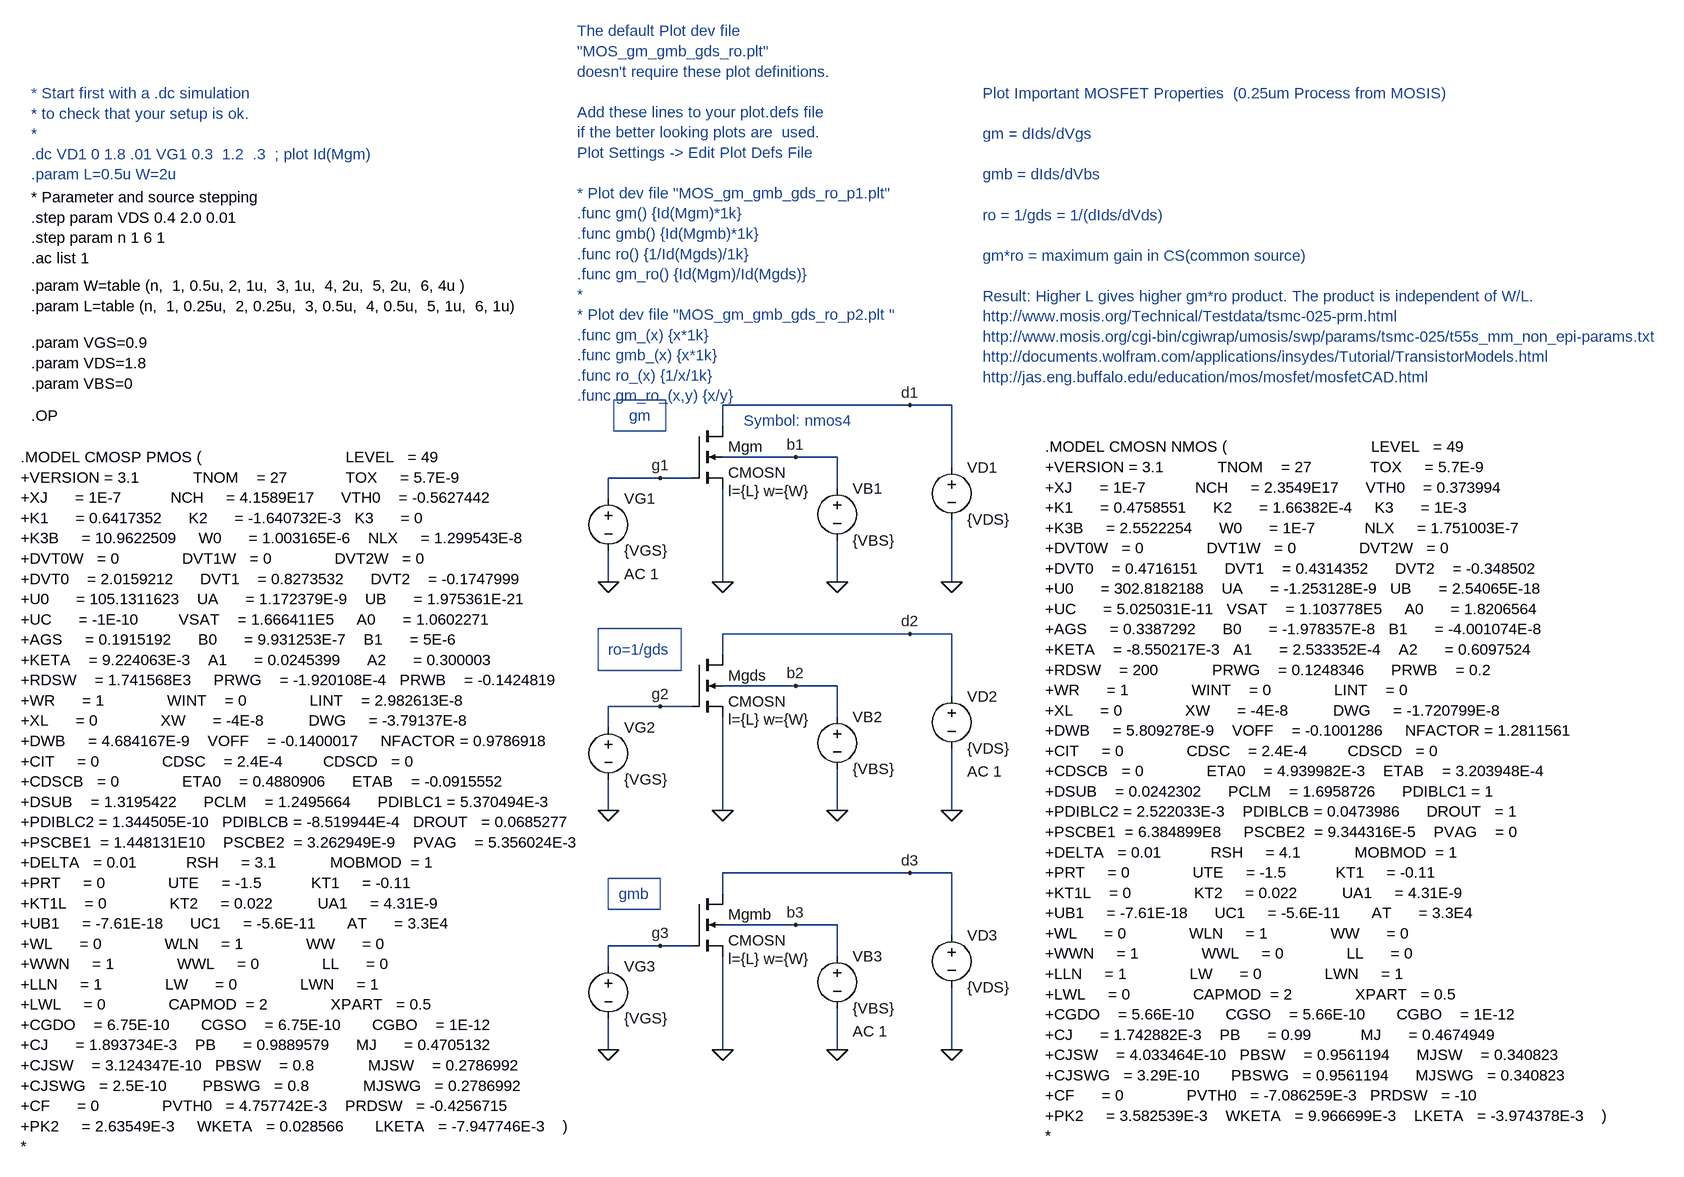
[diagram p0: schematic MOS_gm_gmb_gds_ro.asc]
MOS_gm_gmb_gds_ro.asc, the LTspice schematic file:
Version 4
SHEET 1 3220 2244
WIRE -400 256 -400 224
WIRE -400 384 -400 336
WIRE -400 608 -400 576
WIRE -400 736 -400 688
WIRE -400 976 -400 944
WIRE -400 1104 -400 1056
WIRE -320 224 -400 224
WIRE -320 576 -400 576
WIRE -320 944 -400 944
WIRE -272 224 -320 224
WIRE -272 576 -320 576
WIRE -272 944 -320 944
WIRE -224 144 -224 112
WIRE -224 384 -224 240
WIRE -224 496 -224 464
WIRE -224 736 -224 592
WIRE -224 864 -224 832
WIRE -224 1104 -224 960
WIRE -112 192 -224 192
WIRE -112 544 -224 544
WIRE -112 912 -224 912
WIRE -48 192 -112 192
WIRE -48 240 -48 192
WIRE -48 384 -48 320
WIRE -48 544 -112 544
WIRE -48 592 -48 544
WIRE -48 736 -48 672
WIRE -48 912 -112 912
WIRE -48 960 -48 912
WIRE -48 1104 -48 1040
WIRE 64 112 -224 112
WIRE 64 464 -224 464
WIRE 64 832 -224 832
WIRE 128 112 64 112
WIRE 128 208 128 112
WIRE 128 384 128 288
WIRE 128 464 64 464
WIRE 128 560 128 464
WIRE 128 736 128 640
WIRE 128 832 64 832
WIRE 128 928 128 832
WIRE 128 1104 128 1008
FLAG -400 384 0
FLAG 128 384 0
FLAG -320 224 g1
FLAG -48 384 0
FLAG -224 384 0
FLAG -400 736 0
FLAG 128 736 0
FLAG -320 576 g2
FLAG 64 464 d2
FLAG -48 736 0
FLAG -112 544 b2
FLAG -224 736 0
FLAG -400 1104 0
FLAG 128 1104 0
FLAG -320 944 g3
FLAG 64 832 d3
FLAG -48 1104 0
FLAG -112 912 b3
FLAG -224 1104 0
FLAG -112 192 b1
FLAG 64 112 d1
SYMBOL voltage 128 192 R0
SYMATTR InstName VD1
SYMATTR Value {VDS}
SYMBOL voltage -400 240 R0
WINDOW 123 24 132 Left 0
WINDOW 39 0 0 Left 0
SYMATTR Value2 AC 1
SYMATTR InstName VG1
SYMATTR Value {VGS}
SYMBOL nmos4 -272 144 R0
WINDOW 123 56 100 Left 0
SYMATTR Value2 l={L} w={W}
SYMATTR InstName Mgm
SYMATTR Value CMOSN
SYMBOL voltage -48 224 R0
SYMATTR InstName VB1
SYMATTR Value {VBS}
SYMBOL voltage 128 544 R0
WINDOW 123 24 132 Left 0
WINDOW 39 0 0 Left 0
SYMATTR Value2 AC 1
SYMATTR InstName VD2
SYMATTR Value {VDS}
SYMBOL voltage -400 592 R0
WINDOW 123 24 132 Left 0
WINDOW 39 0 0 Left 0
SYMATTR InstName VG2
SYMATTR Value {VGS}
SYMBOL voltage -48 576 R0
SYMATTR InstName VB2
SYMATTR Value {VBS}
SYMBOL voltage 128 912 R0
SYMATTR InstName VD3
SYMATTR Value {VDS}
SYMBOL voltage -400 960 R0
WINDOW 123 24 132 Left 0
WINDOW 39 0 0 Left 0
SYMATTR InstName VG3
SYMATTR Value {VGS}
SYMBOL voltage -48 944 R0
WINDOW 123 24 132 Left 0
WINDOW 39 0 0 Left 0
SYMATTR Value2 AC 1
SYMATTR InstName VB3
SYMATTR Value {VBS}
SYMBOL nmos4 -272 496 R0
WINDOW 123 56 100 Left 0
SYMATTR Value2 l={L} w={W}
SYMATTR InstName Mgds
SYMATTR Value CMOSN
SYMBOL nmos4 -272 864 R0
WINDOW 123 56 100 Left 0
SYMATTR Value2 l={L} w={W}
SYMATTR InstName Mgmb
SYMATTR Value CMOSN
TEXT -1288 128 Left 0 !.OP
TEXT 272 176 Left 0 !.MODEL CMOSN NMOS (                                LEVEL   = 49\n+VERSION = 3.1            TNOM    = 27             TOX     = 5.7E-9\n+XJ      = 1E-7           NCH     = 2.3549E17      VTH0    = 0.373994\n+K1      = 0.4758551      K2      = 1.66382E-4     K3      = 1E-3\n+K3B     = 2.5522254      W0      = 1E-7           NLX     = 1.751003E-7\n+DVT0W   = 0              DVT1W   = 0              DVT2W   = 0\n+DVT0    = 0.4716151      DVT1    = 0.4314352      DVT2    = -0.348502\n+U0      = 302.8182188    UA      = -1.253128E-9   UB      = 2.54065E-18\n+UC      = 5.025031E-11   VSAT    = 1.103778E5     A0      = 1.8206564\n+AGS     = 0.3387292      B0      = -1.978357E-8   B1      = -4.001074E-8\n+KETA    = -8.550217E-3   A1      = 2.533352E-4    A2      = 0.6097524\n+RDSW    = 200            PRWG    = 0.1248346      PRWB    = 0.2\n+WR      = 1              WINT    = 0              LINT    = 0\n+XL      = 0              XW      = -4E-8          DWG     = -1.720799E-8\n+DWB     = 5.809278E-9    VOFF    = -0.1001286     NFACTOR = 1.2811561\n+CIT     = 0              CDSC    = 2.4E-4         CDSCD   = 0\n+CDSCB   = 0              ETA0    = 4.939982E-3    ETAB    = 3.203948E-4\n+DSUB    = 0.0242302      PCLM    = 1.6958726      PDIBLC1 = 1\n+PDIBLC2 = 2.522033E-3    PDIBLCB = 0.0473986      DROUT   = 1\n+PSCBE1  = 6.384899E8     PSCBE2  = 9.344316E-5    PVAG    = 0\n+DELTA   = 0.01           RSH     = 4.1            MOBMOD  = 1\n+PRT     = 0              UTE     = -1.5           KT1     = -0.11\n+KT1L    = 0              KT2     = 0.022          UA1     = 4.31E-9\n+UB1     = -7.61E-18      UC1     = -5.6E-11       AT      = 3.3E4\n+WL      = 0              WLN     = 1              WW      = 0\n+WWN     = 1              WWL     = 0              LL      = 0\n+LLN     = 1              LW      = 0              LWN     = 1\n+LWL     = 0              CAPMOD  = 2              XPART   = 0.5\n+CGDO    = 5.66E-10       CGSO    = 5.66E-10       CGBO    = 1E-12\n+CJ      = 1.742882E-3    PB      = 0.99           MJ      = 0.4674949\n+CJSW    = 4.033464E-10   PBSW    = 0.9561194      MJSW    = 0.340823\n+CJSWG   = 3.29E-10       PBSWG   = 0.9561194      MJSWG   = 0.340823\n+CF      = 0              PVTH0   = -7.086259E-3   PRDSW   = -10\n+PK2     = 3.582539E-3    WKETA   = 9.966699E-3    LKETA   = -3.974378E-3    )\n*
TEXT -1288 16 Left 0 !.param VGS=0.9\n.param VDS=1.8\n.param VBS=0
TEXT -1288 -208 Left 0 !* Parameter and source stepping\n.step param VDS 0.4 2.0 0.01\n.step param n 1 6 1\n.ac list 1
TEXT -1304 192 Left 0 !.MODEL CMOSP PMOS (                                LEVEL   = 49\n+VERSION = 3.1            TNOM    = 27             TOX     = 5.7E-9\n+XJ      = 1E-7           NCH     = 4.1589E17      VTH0    = -0.5627442\n+K1      = 0.6417352      K2      = -1.640732E-3   K3      = 0\n+K3B     = 10.9622509     W0      = 1.003165E-6    NLX     = 1.299543E-8\n+DVT0W   = 0              DVT1W   = 0              DVT2W   = 0\n+DVT0    = 2.0159212      DVT1    = 0.8273532      DVT2    = -0.1747999\n+U0      = 105.1311623    UA      = 1.172379E-9    UB      = 1.975361E-21\n+UC      = -1E-10         VSAT    = 1.666411E5     A0      = 1.0602271\n+AGS     = 0.1915192      B0      = 9.931253E-7    B1      = 5E-6\n+KETA    = 9.224063E-3    A1      = 0.0245399      A2      = 0.300003\n+RDSW    = 1.741568E3     PRWG    = -1.920108E-4   PRWB    = -0.1424819\n+WR      = 1              WINT    = 0              LINT    = 2.982613E-8\n+XL      = 0              XW      = -4E-8          DWG     = -3.79137E-8\n+DWB     = 4.684167E-9    VOFF    = -0.1400017     NFACTOR = 0.9786918\n+CIT     = 0              CDSC    = 2.4E-4         CDSCD   = 0\n+CDSCB   = 0              ETA0    = 0.4880906      ETAB    = -0.0915552\n+DSUB    = 1.3195422      PCLM    = 1.2495664      PDIBLC1 = 5.370494E-3\n+PDIBLC2 = 1.344505E-10   PDIBLCB = -8.519944E-4   DROUT   = 0.0685277\n+PSCBE1  = 1.448131E10    PSCBE2  = 3.262949E-9    PVAG    = 5.356024E-3\n+DELTA   = 0.01           RSH     = 3.1            MOBMOD  = 1\n+PRT     = 0              UTE     = -1.5           KT1     = -0.11\n+KT1L    = 0              KT2     = 0.022          UA1     = 4.31E-9\n+UB1     = -7.61E-18      UC1     = -5.6E-11       AT      = 3.3E4\n+WL      = 0              WLN     = 1              WW      = 0\n+WWN     = 1              WWL     = 0              LL      = 0\n+LLN     = 1              LW      = 0              LWN     = 1\n+LWL     = 0              CAPMOD  = 2              XPART   = 0.5\n+CGDO    = 6.75E-10       CGSO    = 6.75E-10       CGBO    = 1E-12\n+CJ      = 1.893734E-3    PB      = 0.9889579      MJ      = 0.4705132\n+CJSW    = 3.124347E-10   PBSW    = 0.8            MJSW    = 0.2786992\n+CJSWG   = 2.5E-10        PBSWG   = 0.8            MJSWG   = 0.2786992\n+CF      = 0              PVTH0   = 4.757742E-3    PRDSW   = -0.4256715\n+PK2     = 2.63549E-3     WKETA   = 0.028566       LKETA   = -7.947746E-3    )\n*
TEXT -1288 -368 Left 0 ;* Start first with a .dc simulation\n* to check that your setup is ok.\n*\n.dc VD1 0 1.8 .01 VG1 0.3  1.2  .3  ; plot Id(Mgm)\n.param L=0.5u W=2u
TEXT -368 128 Left 0 ;gm
TEXT -400 488 Left 0 ;ro=1/gds
TEXT -384 864 Left 0 ;gmb
TEXT -1288 -72 Left 0 !.param W=table (n,  1, 0.5u, 2, 1u,  3, 1u,  4, 2u,  5, 2u,  6, 4u )\n.param L=table (n,  1, 0.25u,  2, 0.25u,  3, 0.5u,  4, 0.5u,  5, 1u,  6, 1u)
TEXT -448 -464 Left 0 ;The default Plot dev file \n"MOS_gm_gmb_gds_ro.plt"\ndoesn't require these plot definitions.\n \nAdd these lines to your plot.defs file\nif the better looking plots are  used.\nPlot Settings -> Edit Plot Defs File \n \n* Plot dev file "MOS_gm_gmb_gds_ro_p1.plt" \n.func gm() {Id(Mgm)*1k}\n.func gmb() {Id(Mgmb)*1k}\n.func ro() {1/Id(Mgds)/1k}\n.func gm_ro() {Id(Mgm)/Id(Mgds)}\n*\n* Plot dev file "MOS_gm_gmb_gds_ro_p2.plt "\n.func gm_(x) {x*1k}\n.func gmb_(x) {x*1k}\n.func ro_(x) {1/x/1k}\n.func gm_ro_(x,y) {x/y}
TEXT -192 136 Left 0 ;Symbol: nmos4
TEXT 176 -368 Left 0 ;Plot Important MOSFET Properties  (0.25um Process from MOSIS)\n \ngm = dIds/dVgs\n \ngmb = dIds/dVbs\n \nro = 1/gds = 1/(dIds/dVds)\n \ngm*ro = maximum gain in CS(common source)\n \nResult: Higher L gives higher gm*ro product. The product is independent of W/L.\nhttp://www.mosis.org/Technical/Testdata/tsmc-025-prm.html \nhttp://www.mosis.org/cgi-bin/cgiwrap/umosis/swp/params/tsmc-025/t55s_mm_non_epi-params.txt\nhttp://documents.wolfram.com/applications/insydes/Tutorial/TransistorModels.html\nhttp://jas.eng.buffalo.edu/education/mos/mosfet/mosfetCAD.html
RECTANGLE Normal -312 152 -392 104
RECTANGLE Normal -288 520 -416 456
RECTANGLE Normal -320 888 -400 840

The netlist it stands for:
* MOS_gm_gmb_gds_ro.asc
VD1 d1 0 {VDS}
VG1 g1 0 {VGS} AC 1
Mgm d1 g1 0 b1 CMOSN l={L} w={W}
VB1 b1 0 {VBS}
VD2 d2 0 {VDS} AC 1
VG2 g2 0 {VGS}
VB2 b2 0 {VBS}
VD3 d3 0 {VDS}
VG3 g3 0 {VGS}
VB3 b3 0 {VBS} AC 1
Mgds d2 g2 0 b2 CMOSN l={L} w={W}
Mgmb d3 g3 0 b3 CMOSN l={L} w={W}
.model NMOS NMOS
.model PMOS PMOS
.lib standard.mos
.OP
.MODEL CMOSN NMOS (                                LEVEL   = 49
+VERSION = 3.1            TNOM    = 27             TOX     = 5.7E-9
+XJ      = 1E-7           NCH     = 2.3549E17      VTH0    = 0.373994
+K1      = 0.4758551      K2      = 1.66382E-4     K3      = 1E-3
+K3B     = 2.5522254      W0      = 1E-7           NLX     = 1.751003E-7
+DVT0W   = 0              DVT1W   = 0              DVT2W   = 0
+DVT0    = 0.4716151      DVT1    = 0.4314352      DVT2    = -0.348502
+U0      = 302.8182188    UA      = -1.253128E-9   UB      = 2.54065E-18
+UC      = 5.025031E-11   VSAT    = 1.103778E5     A0      = 1.8206564
+AGS     = 0.3387292      B0      = -1.978357E-8   B1      = -4.001074E-8
+KETA    = -8.550217E-3   A1      = 2.533352E-4    A2      = 0.6097524
+RDSW    = 200            PRWG    = 0.1248346      PRWB    = 0.2
+WR      = 1              WINT    = 0              LINT    = 0
+XL      = 0              XW      = -4E-8          DWG     = -1.720799E-8
+DWB     = 5.809278E-9    VOFF    = -0.1001286     NFACTOR = 1.2811561
+CIT     = 0              CDSC    = 2.4E-4         CDSCD   = 0
+CDSCB   = 0              ETA0    = 4.939982E-3    ETAB    = 3.203948E-4
+DSUB    = 0.0242302      PCLM    = 1.6958726      PDIBLC1 = 1
+PDIBLC2 = 2.522033E-3    PDIBLCB = 0.0473986      DROUT   = 1
+PSCBE1  = 6.384899E8     PSCBE2  = 9.344316E-5    PVAG    = 0
+DELTA   = 0.01           RSH     = 4.1            MOBMOD  = 1
+PRT     = 0              UTE     = -1.5           KT1     = -0.11
+KT1L    = 0              KT2     = 0.022          UA1     = 4.31E-9
+UB1     = -7.61E-18      UC1     = -5.6E-11       AT      = 3.3E4
+WL      = 0              WLN     = 1              WW      = 0
+WWN     = 1              WWL     = 0              LL      = 0
+LLN     = 1              LW      = 0              LWN     = 1
+LWL     = 0              CAPMOD  = 2              XPART   = 0.5
+CGDO    = 5.66E-10       CGSO    = 5.66E-10       CGBO    = 1E-12
+CJ      = 1.742882E-3    PB      = 0.99           MJ      = 0.4674949
+CJSW    = 4.033464E-10   PBSW    = 0.9561194      MJSW    = 0.340823
+CJSWG   = 3.29E-10       PBSWG   = 0.9561194      MJSWG   = 0.340823
+CF      = 0              PVTH0   = -7.086259E-3   PRDSW   = -10
+PK2     = 3.582539E-3    WKETA   = 9.966699E-3    LKETA   = -3.974378E-3    )
*
.param VGS=0.9
.param VDS=1.8
.param VBS=0
* Parameter and source stepping
.step param VDS 0.4 2.0 0.01
.step param n 1 6 1
.ac list 1
.MODEL CMOSP PMOS (                                LEVEL   = 49
+VERSION = 3.1            TNOM    = 27             TOX     = 5.7E-9
+XJ      = 1E-7           NCH     = 4.1589E17      VTH0    = -0.5627442
+K1      = 0.6417352      K2      = -1.640732E-3   K3      = 0
+K3B     = 10.9622509     W0      = 1.003165E-6    NLX     = 1.299543E-8
+DVT0W   = 0              DVT1W   = 0              DVT2W   = 0
+DVT0    = 2.0159212      DVT1    = 0.8273532      DVT2    = -0.1747999
+U0      = 105.1311623    UA      = 1.172379E-9    UB      = 1.975361E-21
+UC      = -1E-10         VSAT    = 1.666411E5     A0      = 1.0602271
+AGS     = 0.1915192      B0      = 9.931253E-7    B1      = 5E-6
+KETA    = 9.224063E-3    A1      = 0.0245399      A2      = 0.300003
+RDSW    = 1.741568E3     PRWG    = -1.920108E-4   PRWB    = -0.1424819
+WR      = 1              WINT    = 0              LINT    = 2.982613E-8
+XL      = 0              XW      = -4E-8          DWG     = -3.79137E-8
+DWB     = 4.684167E-9    VOFF    = -0.1400017     NFACTOR = 0.9786918
+CIT     = 0              CDSC    = 2.4E-4         CDSCD   = 0
+CDSCB   = 0              ETA0    = 0.4880906      ETAB    = -0.0915552
+DSUB    = 1.3195422      PCLM    = 1.2495664      PDIBLC1 = 5.370494E-3
+PDIBLC2 = 1.344505E-10   PDIBLCB = -8.519944E-4   DROUT   = 0.0685277
+PSCBE1  = 1.448131E10    PSCBE2  = 3.262949E-9    PVAG    = 5.356024E-3
+DELTA   = 0.01           RSH     = 3.1            MOBMOD  = 1
+PRT     = 0              UTE     = -1.5           KT1     = -0.11
+KT1L    = 0              KT2     = 0.022          UA1     = 4.31E-9
+UB1     = -7.61E-18      UC1     = -5.6E-11       AT      = 3.3E4
+WL      = 0              WLN     = 1              WW      = 0
+WWN     = 1              WWL     = 0              LL      = 0
+LLN     = 1              LW      = 0              LWN     = 1
+LWL     = 0              CAPMOD  = 2              XPART   = 0.5
+CGDO    = 6.75E-10       CGSO    = 6.75E-10       CGBO    = 1E-12
+CJ      = 1.893734E-3    PB      = 0.9889579      MJ      = 0.4705132
+CJSW    = 3.124347E-10   PBSW    = 0.8            MJSW    = 0.2786992
+CJSWG   = 2.5E-10        PBSWG   = 0.8            MJSWG   = 0.2786992
+CF      = 0              PVTH0   = 4.757742E-3    PRDSW   = -0.4256715
+PK2     = 2.63549E-3     WKETA   = 0.028566       LKETA   = -7.947746E-3    )
*
* * Start first with a .dc simulation
* * to check that your setup is ok.
* *
* .dc VD1 0 1.8 .01 VG1 0.3  1.2  .3  ; plot Id(Mgm)
* .param L=0.5u W=2u
* gm
* ro=1/gds
* gmb
.param W=table (n,  1, 0.5u, 2, 1u,  3, 1u,  4, 2u,  5, 2u,  6, 4u )
.param L=table (n,  1, 0.25u,  2, 0.25u,  3, 0.5u,  4, 0.5u,  5, 1u,  6, 1u)
* The default Plot dev file
* "MOS_gm_gmb_gds_ro.plt"
* doesn't require these plot definitions.
* Add these lines to your plot.defs file
* if the better looking plots are  used.
* Plot Settings -> Edit Plot Defs File
* * Plot dev file "MOS_gm_gmb_gds_ro_p1.plt"
* .func gm() {Id(Mgm)*1k}
* .func gmb() {Id(Mgmb)*1k}
* .func ro() {1/Id(Mgds)/1k}
* .func gm_ro() {Id(Mgm)/Id(Mgds)}
* *
* * Plot dev file "MOS_gm_gmb_gds_ro_p2.plt "
* .func gm_(x) {x*1k}
* .func gmb_(x) {x*1k}
* .func ro_(x) {1/x/1k}
* .func gm_ro_(x,y) {x/y}
* Symbol: nmos4
* Plot Important MOSFET Properties  (0.25um Process from MOSIS)
* gm = dIds/dVgs
* gmb = dIds/dVbs
* ro = 1/gds = 1/(dIds/dVds)
* gm*ro = maximum gain in CS(common source)
* Result: Higher L gives higher gm*ro product. The product is independent of W/L.
* http://www.mosis.org/Technical/Testdata/tsmc-025-prm.html
* http://www.mosis.org/cgi-bin/cgiwrap/umosis/swp/params/tsmc-025/t55s_mm_non_epi-params.txt
* http://documents.wolfram.com/applications/insydes/Tutorial/TransistorModels.html
* http://jas.eng.buffalo.edu/education/mos/mosfet/mosfetCAD.html
.backanno
.end